# EAGLE design matrix (EAGLE 8.1.0)
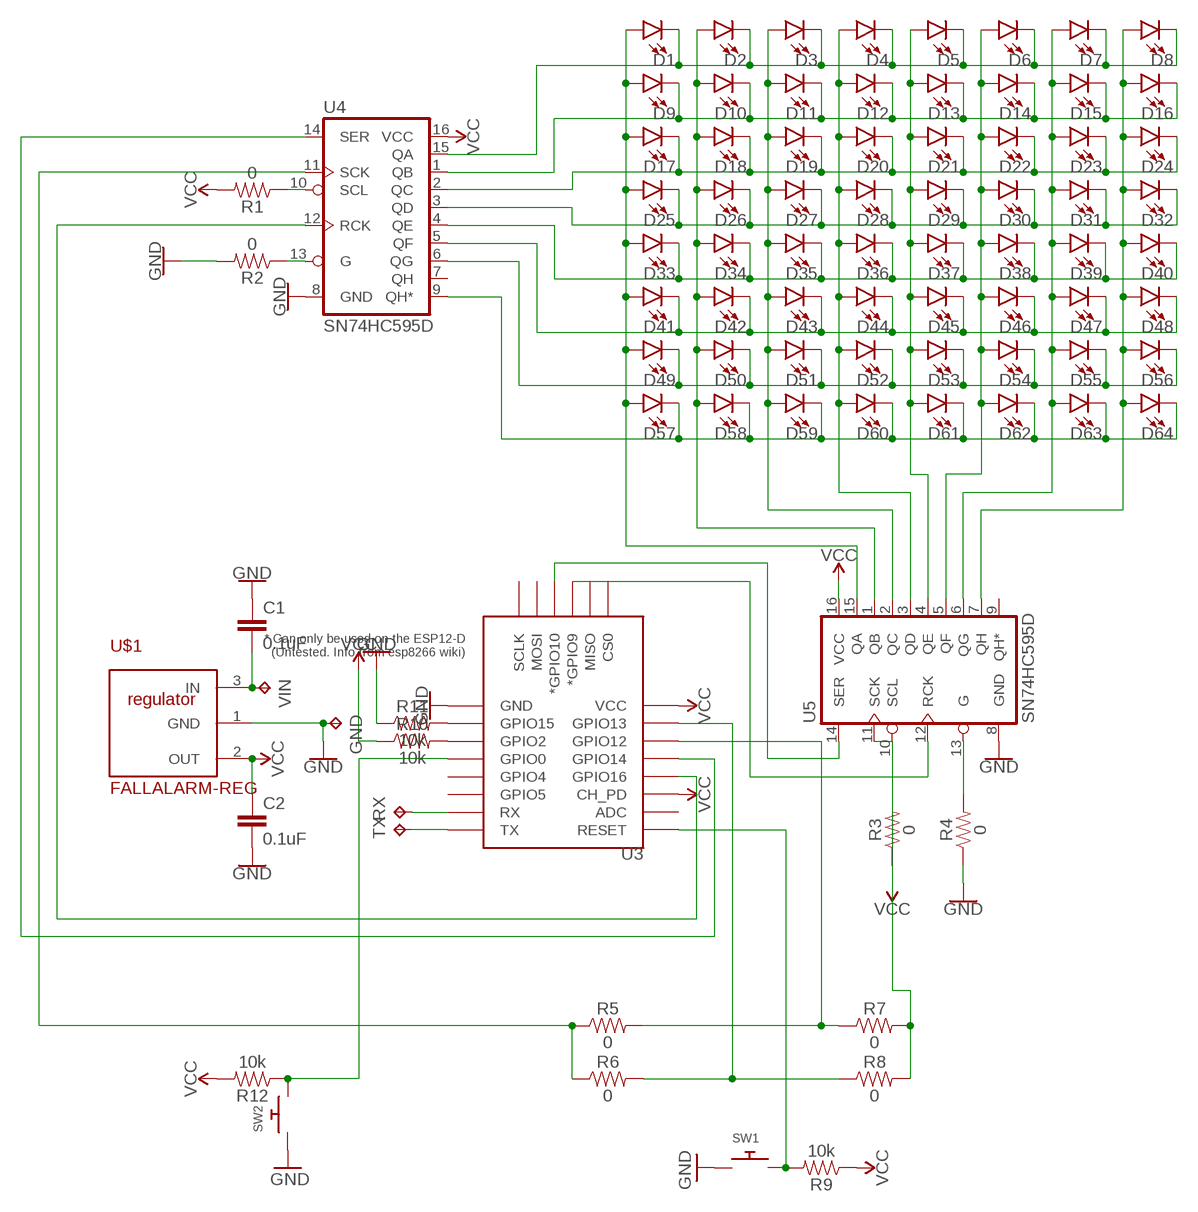
[diagram p0: schematic, sheet 1]

## Parts
C1  0.1uF  0.1UF-0603-25V-(+80/-20%)  [0603]
C2  0.1uF  0.1UF-0603-25V-(+80/-20%)  [0603]
D1  LED0603  [LED-0603]
D2  LED0603  [LED-0603]
D3  LED0603  [LED-0603]
D4  LED0603  [LED-0603]
D5  LED0603  [LED-0603]
D6  LED0603  [LED-0603]
D7  LED0603  [LED-0603]
D8  LED0603  [LED-0603]
D9  LED0603  [LED-0603]
D10  LED0603  [LED-0603]
D11  LED0603  [LED-0603]
D12  LED0603  [LED-0603]
D13  LED0603  [LED-0603]
D14  LED0603  [LED-0603]
D15  LED0603  [LED-0603]
D16  LED0603  [LED-0603]
D17  LED0603  [LED-0603]
D18  LED0603  [LED-0603]
D19  LED0603  [LED-0603]
D20  LED0603  [LED-0603]
D21  LED0603  [LED-0603]
D22  LED0603  [LED-0603]
D23  LED0603  [LED-0603]
D24  LED0603  [LED-0603]
D25  LED0603  [LED-0603]
D26  LED0603  [LED-0603]
D27  LED0603  [LED-0603]
D28  LED0603  [LED-0603]
D29  LED0603  [LED-0603]
D30  LED0603  [LED-0603]
D31  LED0603  [LED-0603]
D32  LED0603  [LED-0603]
D33  LED0603  [LED-0603]
D34  LED0603  [LED-0603]
D35  LED0603  [LED-0603]
D36  LED0603  [LED-0603]
D37  LED0603  [LED-0603]
D38  LED0603  [LED-0603]
D39  LED0603  [LED-0603]
D40  LED0603  [LED-0603]
D41  LED0603  [LED-0603]
D42  LED0603  [LED-0603]
D43  LED0603  [LED-0603]
D44  LED0603  [LED-0603]
D45  LED0603  [LED-0603]
D46  LED0603  [LED-0603]
D47  LED0603  [LED-0603]
D48  LED0603  [LED-0603]
D49  LED0603  [LED-0603]
D50  LED0603  [LED-0603]
D51  LED0603  [LED-0603]
D52  LED0603  [LED-0603]
D53  LED0603  [LED-0603]
D54  LED0603  [LED-0603]
D55  LED0603  [LED-0603]
D56  LED0603  [LED-0603]
D57  LED0603  [LED-0603]
D58  LED0603  [LED-0603]
D59  LED0603  [LED-0603]
D60  LED0603  [LED-0603]
D61  LED0603  [LED-0603]
D62  LED0603  [LED-0603]
D63  LED0603  [LED-0603]
D64  LED0603  [LED-0603]
GND  TPPAD1-17  [P1-17]
R1  0  0OHM-0603-1/10W-5%  [0603]
R2  0  0OHM-0603-1/10W-5%  [0603]
R3  0  0OHM-0603-1/10W-5%  [0603]
R4  0  0OHM-0603-1/10W-5%  [0603]
R5  0  0OHM-0603-1/10W-5%  [0603]
R6  0  0OHM-0603-1/10W-5%  [0603]
R7  0  0OHM-0603-1/10W-5%  [0603]
R8  0  0OHM-0603-1/10W-5%  [0603]
R9  10k  10KOHM-0603-1/10W-1%  [0603]
R10  10k  10KOHM-0603-1/10W-1%  [0603]
R11  10k  10KOHM-0603-1/10W-1%  [0603]
R12  10k  10KOHM-0603-1/10W-1%  [0603]
RX  TPTP20SQ  [TP20SQ]
SW1  SWITCH_PUSHBUTTONEVQ-PE  [TACT_PANA-EVQ]
SW2  SWITCH_PUSHBUTTONEVQ-PE  [TACT_PANA-EVQ]
TX  TPTP20SQ  [TP20SQ]
U3  ESP12ESMD  [ESP12E-SMD]
U4  SN74HC595D  74HC595D  [SO16]
U5  SN74HC595D  74HC595D  [SO16]
U$1  FALLALARM-REG  [SOT23]
VIN  TPPAD1-17  [P1-17]

## Nets
GND: C1.1 C2.2 GND.TP R2.2 R4.1 R11.1 SW1.P$1 SW2.P$1 U3.GND U4.8(GND) U5.8(GND) U$1.1(GND)
N$1: D1.C D2.C D3.C D4.C D5.C D6.C D7.C D8.C U4.15(QA)
N$2: TX.TP U3.TXD0(TX)
N$3: D1.A D9.A D17.A D25.A D33.A D41.A D49.A D57.A U5.15(QA)
N$4: D2.A D10.A D18.A D26.A D34.A D42.A D50.A D58.A U5.1(QB)
N$5: D3.A D11.A D19.A D27.A D35.A D43.A D51.A D59.A U5.2(QC)
N$6: D4.A D12.A D20.A D28.A D36.A D44.A D52.A D60.A U5.3(QD)
N$7: D5.A D13.A D21.A D29.A D37.A D45.A D53.A D61.A U5.4(QE)
N$8: D6.A D14.A D22.A D30.A D38.A D46.A D54.A D62.A U5.5(QF)
N$9: D7.A D15.A D23.A D31.A D39.A D47.A D55.A D63.A U5.6(QG)
N$10: D8.A D16.A D24.A D32.A D40.A D48.A D56.A D64.A U5.7(QH)
N$11: D17.C D18.C D19.C D20.C D21.C D22.C D23.C D24.C U4.2(QC)
N$12: D25.C D26.C D27.C D28.C D29.C D30.C D31.C D32.C U4.3(QD)
N$13: D9.C D10.C D11.C D12.C D13.C D14.C D15.C D16.C U4.1(QB)
N$14: D33.C D34.C D35.C D36.C D37.C D38.C D39.C D40.C U4.4(QE)
N$15: D41.C D42.C D43.C D44.C D45.C D46.C D47.C D48.C U4.5(QF)
N$16: U3.GPIO14 U4.14(SER)
N$17: U3.GPIO10(*GPIO10) U5.14(SER)
N$18: U3.GPIO9(*GPIO9) U5.12(RCK)
N$19: U3.GPIO16 U4.12(RCK)
N$20: R1.1 U4.10(SCL)
N$21: R3.2 U5.10(SCL)
N$22: R2.1 U4.13(G)
N$23: R4.2 U5.13(G)
N$24: R5.1 R6.1 U4.11(SCK)
N$25: D57.C D58.C D59.C D60.C D61.C D62.C D63.C D64.C U4.9(QH*)
N$26: C1.2 U$1.3(IN) VIN.TP
N$27: RX.TP U3.RXD0(RX)
N$28: R5.2 R7.1 U3.GPIO12
N$29: D49.C D50.C D51.C D52.C D53.C D54.C D55.C D56.C U4.6(QG)
N$30: R10.2 U3.GPIO2
N$31: R11.2 U3.GPIO15
N$32: R9.2 SW1.P$2
N$33: R6.2 R8.1 U3.GPIO13
N$34: R7.2 R8.2 U5.11(SCK)
N$35: R12.1 SW2.P$2 U3.GPIO0
VCC: C2.1 R1.2 R3.1 R9.1 R10.1 R12.2 U3.CH_PD U3.VCC U4.16(VCC) U5.16(VCC) U$1.2(OUT)
Unconnected: U3.ADC U3.CS0 U3.GPIO4 U3.GPIO5 U3.MISO U3.MOSI U3.RESET U3.SCLK U4.7(QH) U5.9(QH*)

## Library data of the parts
C1 C2 = SparkFun-Capacitors:0.1UF: 0.1µF ceramic capacitors A capacitor is a passive two-terminal electrical component used to store electrical energy temporarily in an electric field.; PROD_ID: CAP-00810
D1-D64 = SparkFun-LED:LED: LED (Generic) Standard schematic elements and footprints for 5mm, 3mm, 1206, and 0603 sized LEDs. Generic LEDs with no color specified.
GND RX TX VIN = testpad:TP: Test pad
R1-R8 = SparkFun-Resistors:0OHM: 0Ω resistor A resistor is a passive two-terminal electrical component that implements electrical resistance as a circuit element. Resistors act to reduce current flow, and, at the same time, act to lower voltage levels within circuits. - Wikipedia; PROD_ID: RES-08609
R9-R12 = SparkFun-Resistors:10KOHM: 10kΩ resistor A resistor is a passive two-terminal electrical component that implements electrical resistance as a circuit element. Resistors act to reduce current flow, and, at the same time, act to lower voltage levels within circuits. - Wikipedia; PROD_ID: RES-00824
SW1 SW2 = adafruit:SWITCH_PUSHBUTTON: Buttons SOFTTOUCHSMD_SJ - Soft touch temporary push button (Super Junk Akihabara) Compatible with SKPMANE010 [Mouser: 688-SKPMAN] C&K_KSS = Digikey: KSS221GLFS
U3 = esp8266modules:ESP12E: ESP12E Module
U4 U5 = SparkFun-IC-Logic:74*595: 8-Bit Shift Register (Serial to Parallel) Datasheet <http://cdn.sparkfun.com/datasheets/BreakoutBoards/MM74HC595.pdf> SparkFun Products SparkFun Shift Register Breakout - 74HC595 <https://www.sparkfun.com/products/10680> (BOB-10680); PROD_ID: IC-07875
U$1 = v-reg:FALLALARM-REG

## Board
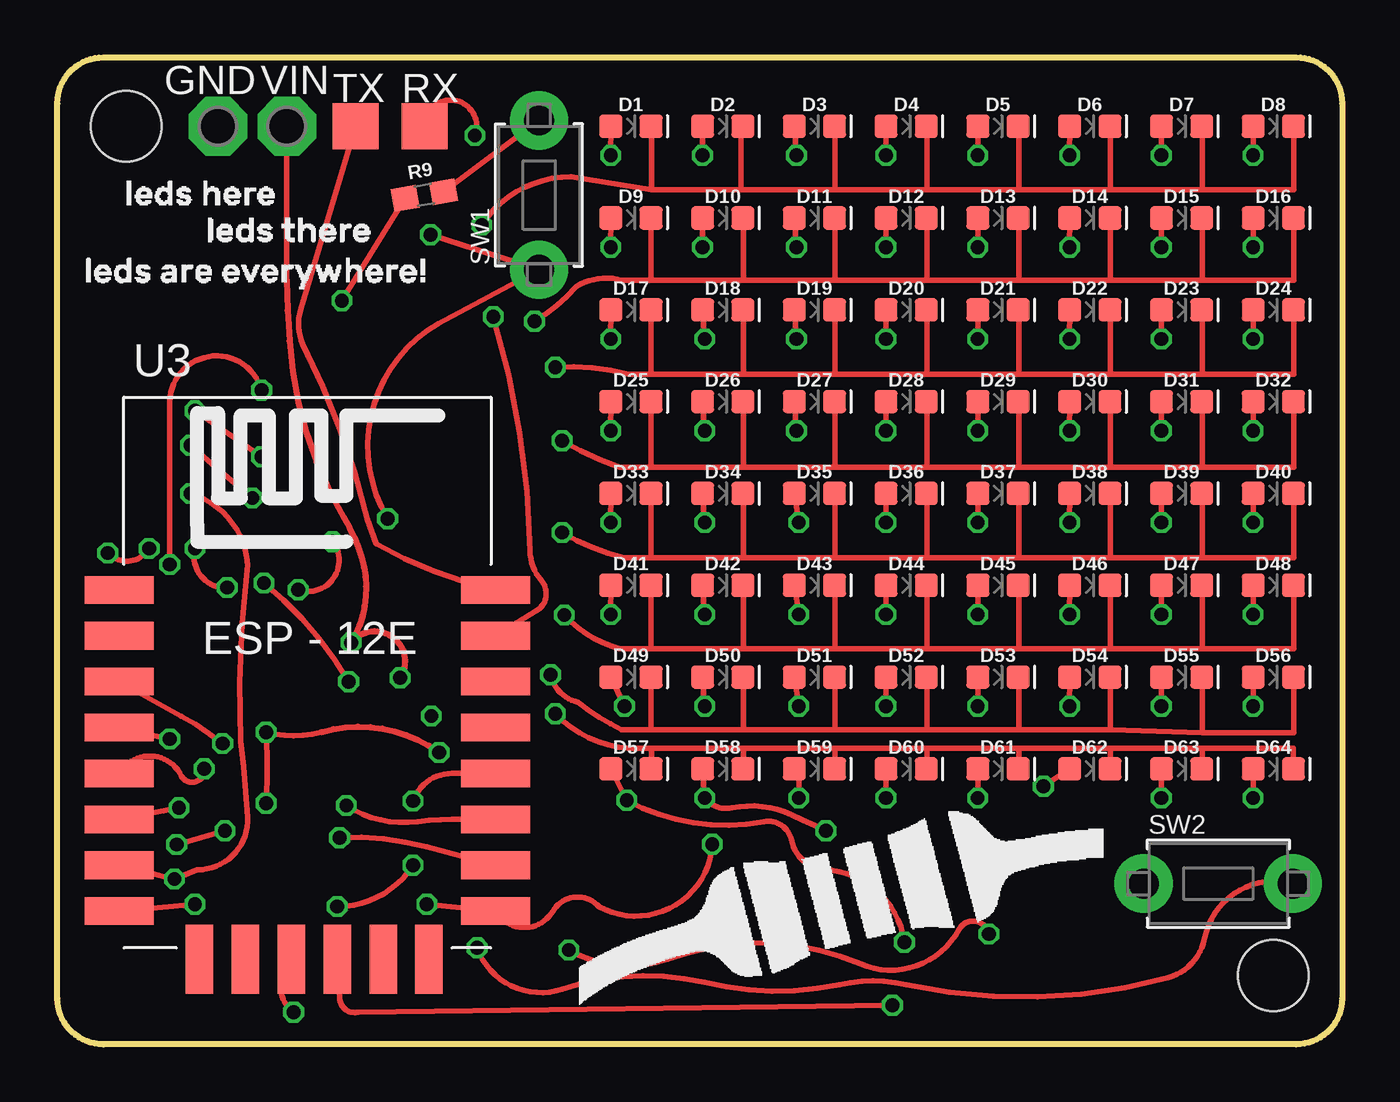
[diagram p1: board, top side]
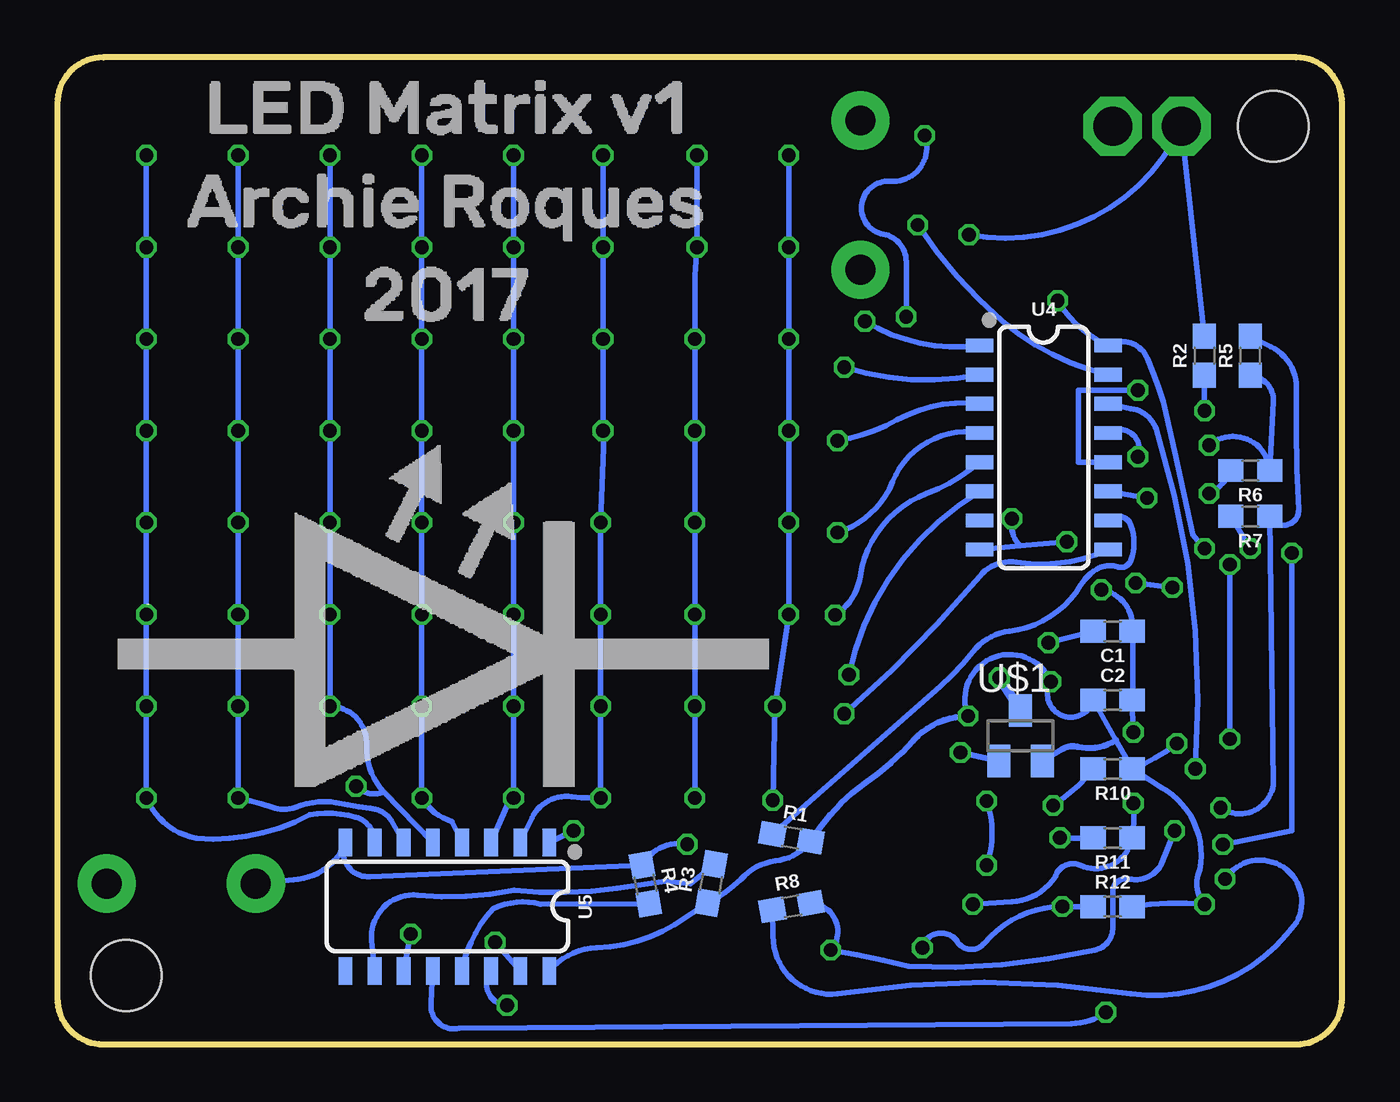
[diagram p2: board, bottom side, seen from below]

Size 56 x 43 mm. Coordinates in mm from the lower left corner, seen from the top.
Outline: 0,41 arc-90 2,43 54,43 arc-90 56,41 56,2 arc-90 54,0 2,0 arc-90 0,2 0,41
Copper layers (1*16): Top 0.035mm / dielectric 1.5mm / Bottom 0.035mm
Design rules "SeeedStudio_2layer_DRU_no_angle_20140221": minimum track width 6mil, minimum drill 12mil, track to track 6mil, track to pad 6mil, pad to pad 6mil, via to via 6mil, smd to smd 0mil, copper to edge 10mil, drill to drill 10mil, minimum pad ring 10mil, minimum via ring 6mil, stop-mask expansion 2mil, vias tented up to drill 100mil, thermal gap 10mil
Holes 3.1 mm at 3,40 53,3

### Footprints (pad centres in the part's own frame; a part is rotated, then mirrored left to right if it is on the bottom)
0603 = smd 1.1 x 1: 1 -0.85,0; 2 0.85,0
LED-0603 = smd 1 x 1: A -0.877,0; C 0.877,0
P1-17 = drill 1.702 pad 2.54 octagon: TP 0,0
TP20SQ = smd 2 x 2: TP 0,0
TACT_PANA-EVQ = drill 1.3 pad 2.54: P$1 -3.25,0; P$2 3.25,0
ESP12E-SMD = smd 3 x 1.2: ADC -8.3,3.8; CH_PD -8.3,1.8; GND 8.1,-8.2; GPIO0 8.1,-2.2; GPIO2 8.1,-4.2; GPIO4 8.1,-0.2; GPIO5 8.1,1.8; GPIO12 -8.3,-4.2; GPIO13 -8.3,-6.2; GPIO14 -8.3,-2.2; GPIO15 8.1,-6.2; GPIO16 -8.3,-0.2; RESET -8.3,5.8; RXD0 8.1,3.8; TXD0 8.1,5.8; VCC -8.3,-8.2 | smd 1.2 x 3: CS0 -4.8,-10.3; GPIO9 -0.8,-10.3; GPIO10 1.2,-10.3; MISO -2.8,-10.3; MOSI 3.2,-10.3; SCLK 5.2,-10.3
SO16 = smd 0.6 x 1.2: 1 -4.445,-2.8; 2 -3.175,-2.8; 3 -1.905,-2.8; 4 -0.635,-2.8; 5 0.635,-2.8; 6 1.905,-2.8; 7 3.175,-2.8; 8 4.445,-2.8; 9 4.445,2.8; 10 3.175,2.8; 11 1.905,2.8; 12 0.635,2.8; 13 -0.635,2.8; 14 -1.905,2.8; 15 -3.175,2.8; 16 -4.445,2.8
SOT23 = smd 1 x 1.4: 1 -0.95,-1.1; 2 0.95,-1.1; 3 0,1.1

### Placement (x,y rotation side)
C1  10,18 180 bottom
C2  10,15 0 bottom
D1  25,40 0 top
D2  29,40 0 top
D3  33,40 0 top
D4  37,40 0 top
D5  41,40 0 top
D6  45,40 0 top
D7  49,40 0 top
D8  53,40 0 top
D9  25,36 0 top
D10  29,36 0 top
D11  33,36 0 top
D12  37,36 0 top
D13  41,36 0 top
D14  45,36 0 top
D15  49,36 0 top
D16  53,36 0 top
D17  25,32 0 top
D18  29,32 0 top
D19  33,32 0 top
D20  37,32 0 top
D21  41,32 0 top
D22  45,32 0 top
D23  49,32 0 top
D24  53,32 0 top
D25  25,28 0 top
D26  29,28 0 top
D27  33,28 0 top
D28  37,28 0 top
D29  41,28 0 top
D30  45,28 0 top
D31  49,28 0 top
D32  53,28 0 top
D33  25,24 0 top
D34  29,24 0 top
D35  33,24 0 top
D36  37,24 0 top
D37  41,24 0 top
D38  45,24 0 top
D39  49,24 0 top
D40  53,24 0 top
D41  25,20 0 top
D42  29,20 0 top
D43  33,20 0 top
D44  37,20 0 top
D45  41,20 0 top
D46  45,20 0 top
D47  49,20 0 top
D48  53,20 0 top
D49  25,16 0 top
D50  29,16 0 top
D51  33,16 0 top
D52  37,16 0 top
D53  41,16 0 top
D54  45,16 0 top
D55  49,16 0 top
D56  53,16 0 top
D57  25,12 0 top
D58  29,12 0 top
D59  33,12 0 top
D60  37,12 0 top
D61  41,12 0 top
D62  45,12 0 top
D63  49,12 0 top
D64  53,12 0 top
GND  7,40 0 top
R1  24,9 350 bottom
R2  6,30 90 bottom
R3  27.5,7 80 bottom
R4  30.37,6.97 280 bottom
R5  4,30 90 bottom
R6  4,25 180 bottom
R7  4,23 180 bottom
R8  24,6 10 bottom
R9  16,37 10 top
R10  10,12 180 bottom
R11  10,9 180 bottom
R12  10,6 0 bottom
RX  16,40 0 top
SW1  21,37 90 top
SW2  50.6,7 0 top
TX  13,40 0 top
U3  11,14 0 top
U4  13,26 270 bottom
U5  39,6 180 bottom
U$1  14.02,13.44 0 bottom
VIN  10,40 0 top

### Tracks (layer width: path | path; a pad name or v marks a point on that pad's centre or on a via)
GND  (via drill 0.6)
  Top 0.25: v28.54,8.71 arc-115 23.6,6 arc108 21.6,5.8 arc-119 U3.GND v16.1,6.1 | v9.1,10.5 arc7 v9.1,13.6 arc28 11.5,13.6 | v10.5,19.8 arc146 v12,21.9 | v14.4,22.9 arc-91 16.6,31.4 SW1.P$1 v16.27,35.28
  Top 0.254: 11.5,13.6 arc-52 v16.64,12.71
  Bottom 0.25: v28.54,8.71 arc-70 R4.1 42.4,7.3 arc116 U5.8 arc63 45.5,7.2 SW2.P$1 | v9.1,10.5 arc14 R11.1 arc106 11.4,7.8 arc-98 12.5,7.3 arc53 14.4,6.2 v16.1,6.1 | v9.1,13.6 arc1 C2.2 arc-5 C1.1 arc-89 v10.5,19.8 | 14.06,21.71 U4.8 | 14.06,21.71 v12,21.9 | v14.4,22.9 arc-51 14.06,21.71 | R2.2 GND.TP arc75 v16.27,35.28
  Bottom 0.254: v16.64,12.71 U$1.1
N$1  (via drill 0.6)
  Top 0.25: D8.C 53.9,40 53.9,37.24 49.9,37.24 | 29.8,37.24 25.9,37.24 | 33.9,37.24 29.8,37.24 | 37.9,37.24 33.9,37.24 | 41.9,37.24 37.9,37.24 | 45.9,37.24 41.9,37.24 | 49.9,37.24 45.9,37.24 | 25.9,37.24 22.4,37.8 arc57 v18.5,35.7 | D1.C 25.9,40 25.9,37.24 | D2.C 29.8,40 29.8,37.24 | D3.C 33.9,40 33.9,37.24 | D4.C 37.9,40 37.9,37.24 | D5.C 41.9,40 41.9,37.24 | D6.C 45.9,40 45.9,37.24 | D7.C 49.9,40 49.9,37.24
  Bottom 0.25: v18.5,35.7 arc-16 14.8,31.5 arc-28 U4.15
N$2
  Top 0.25: TX.TP 10.6,32 arc41 10.7,30.5 arc-14 13.5,22.9 13.9,21.8 arc16 U3.TXD0
N$3  (via drill 0.6)
  Top 0.25: v36.92,4.44 arc82 33.4,7.6 arc-71 32,8.9 arc89 30.8,9.7 arc-39 v24.82,10.63 D57.A | D1.A v24.12,38.73 | v24.12,34.73 D9.A | v24.12,30.73 D17.A | v24.12,26.73 D25.A | v24.12,22.73 D33.A | v24.12,18.73 D41.A | v24.72,14.73 D49.A
  Bottom 0.25: U5.15 v36.92,4.44 | v24.12,38.73 v24.12,34.73 v24.12,30.73 v24.12,26.73 v24.12,22.73 v24.12,18.73 v24.72,14.73 v24.82,10.63
N$4  (via drill 0.6)
  Top 0.25: v33.5,9.3 arc1 32,10 arc36 29.4,10.3 arc-63 v28.22,10.73 D58.A | D2.A v28.12,38.73 | v28.12,34.73 D10.A | v28.22,30.73 D18.A | v28.22,26.73 D26.A | v28.22,22.73 D34.A | v28.22,18.73 D42.A | v28.22,14.73 D50.A
  Bottom 0.25: U5.1 v33.5,9.3 | v28.12,38.73 v28.12,34.73 28.2,33.5 v28.22,30.73 v28.22,26.73 v28.22,22.73 v28.22,18.73 v28.22,14.73 v28.22,10.73
N$5  (via drill 0.6)
  Top 0.25: D3.A v32.22,38.73 | v32.22,34.73 D11.A | v32.22,30.73 D19.A | v32.22,26.73 D27.A | v32.32,22.73 D35.A | v32.32,18.73 D43.A | v32.32,14.73 D51.A | D59.A 32.32,12 v32.32,10.73
  Bottom 0.25: v32.22,38.73 v32.22,34.73 v32.22,30.73 v32.22,26.73 32.2,26 v32.32,22.73 v32.32,18.73 v32.32,14.73 v32.32,10.73 arc6 33.58,10.78 arc-73 35.31,9.87 U5.2
N$6  (via drill 0.6)
  Top 0.25: D4.A v36.12,38.73 | v36.12,34.73 D12.A | v36.12,30.73 D20.A | v36.12,26.73 D28.A | v36.12,22.73 D36.A | v36.12,18.73 D44.A | v36.12,14.73 D52.A | v36.12,10.73 D60.A
  Bottom 0.25: U5.3 36.4,10.4 arc35 v36.12,10.73 v36.12,14.73 v36.12,18.73 v36.12,22.73 v36.12,26.73 v36.12,30.73 v36.12,34.73 v36.12,38.73
N$7  (via drill 0.6)
  Top 0.25: D5.A v40.12,38.73 | v40.12,34.73 D13.A | v40.12,30.73 D21.A | v40.12,26.73 D29.A | v40.12,22.73 D37.A | v40.12,18.73 D45.A | v40.12,14.73 D53.A | v40.12,10.73 D61.A
  Bottom 0.25: v40.12,38.73 v40.12,34.73 v40.12,30.73 v40.12,26.73 v40.12,22.73 v40.12,18.73 v40.12,14.73 v40.12,10.73 arc-42 38.8,9.7 U5.4
N$8  (via drill 0.6)
  Top 0.25: D6.A v44.12,38.73 | v44.12,34.73 D14.A | v44.12,30.73 D22.A | v44.12,26.73 D30.A | v44.12,22.73 D38.A | v44.12,18.73 D46.A | v44.12,14.73 D54.A | D62.A v42.98,11.24
  Bottom 0.25: v44.12,38.73 v44.12,34.73 v44.12,30.73 v44.12,26.73 v44.12,22.73 v44.12,18.73 v44.12,14.73 arc92 42.52,13.02 arc-47 41.76,10.99 | 41.76,10.99 U5.5 | v42.98,11.24 arc-66 41.76,10.99
N$9  (via drill 0.6)
  Top 0.25: D7.A v48.12,38.73 | v48.12,34.73 D15.A | v48.12,30.73 D23.A | v48.12,26.73 D31.A | v48.12,22.73 D39.A | v48.12,18.73 D47.A | v48.12,14.73 D55.A | v48.12,10.73 D63.A
  Bottom 0.25: v48.12,38.73 v48.12,34.73 v48.12,30.73 v48.12,26.73 v48.12,22.73 v48.12,18.73 v48.12,14.73 v48.12,10.73 arc6 46.64,10.33 arc-36 45.62,10.33 arc31 43.84,10.53 arc-5 42.37,10.27 arc53 41.46,9.77 U5.6
N$10  (via drill 0.6)
  Top 0.25: D8.A v52.12,38.73 | v52.12,34.73 D16.A | v52.12,30.73 D24.A | v52.12,26.73 D32.A | v52.12,22.73 D40.A | v52.12,18.73 D48.A | v52.12,14.73 D56.A | v52.12,10.73 D64.A
  Bottom 0.25: U5.7 arc-76 43,9.9 arc-25 45,10 arc33 49.95,8.97 arc56 v52.12,10.73 v52.12,14.73 v52.12,18.73 v52.12,22.73 v52.12,26.73 v52.12,30.73 v52.12,34.73 v52.12,38.73
N$11  (via drill 0.6)
  Top 0.25: D24.C 53.9,32 53.9,29.19 49.9,29.19 | 33.9,29.19 29.9,29.19 | 37.9,29.19 33.9,29.19 | 41.9,29.19 37.9,29.19 | 45.9,29.19 41.9,29.19 | 49.9,29.19 45.9,29.19 | 29.9,29.19 25.88,29.19 | 25.88,29.19 D17.C | D18.C 29.9,32 29.9,29.19 | D19.C 33.9,32 33.9,29.19 | D20.C 37.9,32 37.9,29.19 | D21.C 41.9,32 41.9,29.19 | D22.C 45.9,32 45.9,29.19 | D23.C 49.9,32 49.9,29.19 | 25.88,29.19 24.9,29.19 arc18 v21.7,29.5
  Bottom 0.25: v21.7,29.5 arc-29 U4.2
N$12  (via drill 0.6)
  Top 0.25: D32.C 53.9,28 53.9,25.14 49.9,25.14 | 33.9,25.14 29.9,25.14 | 37.9,25.14 33.9,25.14 | 41.9,25.14 37.9,25.14 | 45.9,25.14 41.9,25.14 | 49.9,25.14 45.9,25.14 | 29.9,25.14 26,25.14 25.88,25.14 | 25.88,25.14 D25.C | D26.C 29.9,28 29.9,25.14 | D27.C 33.9,28 33.9,25.14 | D28.C 37.9,28 37.9,25.14 | D29.C 41.9,28 41.9,25.14 | D30.C 45.9,28 45.9,25.14 | D31.C 49.9,28 49.9,25.14 | 25.88,25.14 24.5,25.14 arc-9 v22,26.3
  Bottom 0.25: v22,26.3 arc-20 19.4,27.2 arc36 U4.3
N$13  (via drill 0.6)
  Top 0.25: D16.C 53.9,36 53.9,33.29 49.9,33.29 | 33.9,33.29 29.9,33.29 | 37.9,33.29 33.9,33.29 | 41.9,33.29 37.9,33.29 | 45.9,33.29 41.9,33.29 | 49.9,33.29 45.9,33.29 | 29.9,33.29 25.88,33.29 | 25.88,33.29 D9.C | D10.C 29.9,36 29.9,33.29 | D11.C 33.9,36 33.9,33.29 | D12.C 37.9,36 37.9,33.29 | D13.C 41.9,36 41.9,33.29 | D14.C 45.9,36 45.9,33.29 | D15.C 49.9,36 49.9,33.29 | 25.88,33.29 24.6,33.29 arc48 22.6,33 arc-17 v20.8,31.5
  Bottom 0.25: v20.8,31.5 arc-38 U4.1
N$14  (via drill 0.6)
  Top 0.25: D40.C 53.9,24 53.9,21.19 49.9,21.19 | 33.9,21.19 29.9,21.19 | 37.9,21.19 33.9,21.19 | 41.9,21.19 37.9,21.19 | 45.9,21.19 41.9,21.19 | 49.9,21.19 45.9,21.19 | 29.9,21.19 25.88,21.19 | 25.88,21.19 D33.C | D34.C 29.9,24 29.9,21.19 | D35.C 33.9,24 33.9,21.19 | D36.C 37.9,24 37.9,21.19 | D37.C 41.9,24 41.9,21.19 | D38.C 45.9,24 45.9,21.19 | D39.C 49.9,24 49.9,21.19 | 25.88,21.19 24.7,21.19 arc-17 v22,22.3
  Bottom 0.25: v22,22.3 arc-51 19.6,24.5 arc78 U4.4
N$15  (via drill 0.6)
  Top 0.25: D48.C 53.9,20 53.9,17.24 49.9,17.24 | 33.9,17.24 29.9,17.24 | 37.9,17.24 33.9,17.24 | 41.9,17.24 37.9,17.24 | 45.9,17.24 41.9,17.24 | 49.9,17.24 45.9,17.24 | 29.9,17.24 25.88,17.24 | 25.88,17.24 D41.C | D42.C 29.9,20 29.9,17.24 | D43.C 33.9,20 33.9,17.24 | D44.C 37.9,20 37.9,17.24 | D45.C 41.9,20 41.9,17.24 | D46.C 45.9,20 45.9,17.24 | D47.C 49.9,20 49.9,17.24 | 25.88,17.24 24.5,17.24 arc-33 v22.1,18.7
  Bottom 0.25: v22.1,18.7 arc-49 21,20.4 arc61 18.1,24 arc-20 U4.5
N$16  (via drill 0.6)
  Top 0.25: v6.4,12 arc-159 5.4,11.7 arc124 U3.GPIO14
  Bottom 0.25: U4.14 9.2,27.7 arc61 8.1,26.8 arc22 v6.4,12
N$17  (via drill 0.6)
  Top 0.25: U3.GPIO10 12.3,2 arc100 13.1,1.4 v36.4,1.7
  Bottom 0.25: v36.4,1.7 arc125 U5.14
N$18  (via drill 0.6)
  Top 0.25: v10.3,1.4 arc-101 U3.GPIO9
  Bottom 0.25: U5.12 39.7,1.8 arc-112 38.5,0.7 11.8,0.9 arc-37 v10.3,1.4
N$19  (via drill 0.6)
  Top 0.25: U3.GPIO16 v4.9,13.3 | v4.9,20.9 4.9,28 arc-163 v8.9,28.5
  Bottom 0.25: v4.9,13.3 v4.9,20.9 | v8.9,28.5 11.5,28.5 11.5,25.36 U4.12
N$20
  Bottom 0.25: R1.1 17.5,15.6 arc-10 16.1,17.1 arc45 14.5,18 arc-52 11.4,20 arc28 10.7,20.7 arc49 9.8,20.8 arc-90 9.2,21.1 arc-37 9.2,22.6 arc-118 U4.10
N$21
  Bottom 0.25: U5.10 42.3,4.5 arc101 40.3,6.5 arc-16 36.1,6.7 arc-14 31.6,6.8 29.5,7.1 28.4,7 R3.2
N$22  (via drill 0.6)
  Top 0.25: v6,27.6 v8.9,25.6
  Bottom 0.25: R2.1 v6,27.6 | v8.9,25.6 arc-146 U4.13
N$23
  Bottom 0.25: R4.2 34.95,6.1 arc-42 37,5.91 arc-33 U5.13
N$24  (via drill 0.6)
  Top 0.25: v8.5,23.8 v5.8,26.1
  Bottom 0.25: R5.1 arc88 3,28 R6.1 arc-126 v5.8,26.1 | U4.11 v8.5,23.8
N$25  (via drill 0.6)
  Top 0.25: D57.C 25.9,12 25.9,12.89 | 29.9,12.89 25.9,12.89 | 33.9,12.89 29.9,12.89 | 37.9,12.89 33.9,12.89 | 41.9,12.89 37.9,12.89 | 45.9,12.89 41.9,12.89 | 49.9,12.89 45.9,12.89 | 49.9,12.89 53.88,12.89 D64.C | D58.C 29.9,12 29.9,12.89 | D59.C 33.9,12 33.9,12.89 | D60.C 37.9,12 37.9,12.89 | D61.C 41.9,12 41.9,12.89 | D62.C 45.9,12 45.9,12.89 | D63.C 49.9,12 49.9,12.89 | 25.9,12.89 24.9,12.89 arc-41 v21.7,14.4
  Bottom 0.25: v21.7,14.4 arc-9 15.8,20.4 arc59 14.2,21 arc-33 U4.9
N$26  (via drill 0.6)
  Top 0.25: VIN.TP 10,33.3
  Top 0.254: v14.94,15.97 arc174 v12.8,17.5 arc48 13.26,21.2 arc14 12.5,22.92 arc-23 10.27,29.33 arc-8 10,33.3
  Bottom 0.25: v12.8,17.5 C1.2
  Bottom 0.406: U$1.3 v14.94,15.97
N$27  (via drill 0.6)
  Top 0.25: U3.RXD0 20.9,18.9 arc100 21.1,20.2 arc-40 20.6,21.5 arc16 v19,31.7 | v18.2,39.6 arc201 RX.TP
  Bottom 0.25: v19,31.7 19,34.1 arc-80 20,35.3 arc174 19.7,37.6 arc-115 v18.2,39.6
N$28  (via drill 0.6)
  Top 0.25: v5.3,10.3 U3.GPIO12
  Bottom 0.25: R5.2 3.1,30.4 arc64 2,28.6 arc-3 1.9,23.3 arc158 R7.1 3,11.3 arc115 v5.3,10.3
N$29  (via drill 0.6)
  Top 0.25: D56.C 53.9,16 53.9,13.58 49.9,13.58 | 45.9,13.7 49.9,13.58 | 41.9,13.7 45.9,13.7 | 37.9,13.7 41.9,13.7 | 33.9,13.7 37.9,13.7 | 29.9,13.7 33.9,13.7 | 29.9,13.7 25.88,13.7 | 25.88,13.7 D49.C | D55.C 49.9,16 49.9,13.58 | D54.C 45.9,16 45.9,13.7 | D53.C 41.9,16 41.9,13.7 | D52.C 37.9,16 37.9,13.7 | D51.C 33.9,16 33.9,13.7 | D50.C 29.9,16 29.9,13.7 | 25.88,13.7 24.6,13.7 arc-12 22.7,14.9 arc-66 v21.5,16.1
  Bottom 0.25: v21.5,16.1 arc47 U4.6
N$30  (via drill 0.6)
  Top 0.25: U3.GPIO2 17.2,9.8 arc8 15.7,9.7 arc-41 v12.6,10.4
  Bottom 0.25: v12.6,10.4 arc-19 R10.2
N$31  (via drill 0.6)
  Top 0.25: U3.GPIO15 16.1,8.6 arc18 v12.3,9
  Bottom 0.25: v12.3,9 arc-6 R11.2
N$32
  Top 0.25: SW1.P$2 R9.2
N$33  (via drill 0.6)
  Top 0.25: U3.GPIO13 v5.1,7.2 6.1,7.6 arc93 8.3,9.9 arc2 8,13.2 arc-10 8.3,20.9 arc69 v5.8,24
  Bottom 0.25: R8.1 24.8,4.7 arc-97 22,2.2 arc18 9.2,2.2 arc-62 2,5.3 arc-176 v5.1,7.2 | v5.8,24 arc-40 R6.2
N$34  (via drill 0.6)
  Top 0.25: v40.6,4.8 arc141 39.3,5 arc-85 35,3.5 arc44 26.6,3.7 arc-48 v22.29,4.1 | v4,21.6 arc-105 v2.2,21.4 | v5.2,8.7 v7.3,9.3
  Bottom 0.25: U5.11 v40.6,4.8 | R8.2 arc129 v22.29,4.1 arc5 18.9,3.4 arc-16 10.8,4.1 arc-86 10,5.2 10,6.7 arc95 9.3,7.2 arc-70 7.9,7.8 v7.3,9.3 | R7.2 v4,21.6 | v2.2,21.4 2.2,9.3 v5.2,8.7
N$35  (via drill 0.6)
  Top 0.25: v15.5,7.8 arc-57 v12.2,6 | U3.GPIO0 17.2,11.8 arc70 v15.5,10.6 | v18.3,4.2 arc89 22,2.4 arc-31 28.2,2.7 arc26 34.1,2.6 arc-26 37,2.6 arc28 48.4,2.9 arc64 50,4.6 arc-93 SW2.P$2
  Bottom 0.25: R12.1 v12.2,6 arc-50 15.6,4.4 arc110 16.8,4.5 arc-130 v18.3,4.2 | v15.5,10.6 arc39 v15.5,7.8
VCC  (via drill 0.6)
  Top 0.25: U3.VCC v6,6.1 | R9.1 v12.4,32.4 | v9,20.1 arc-20 v12.7,15.8 | U3.CH_PD 5.4,14.3 arc-9 v7.2,13.1 | v7.4,19.9 arc-108 v6,21.6
  Bottom 0.25: U5.16 arc48 32.5,4.2 arc-29 29.1,5.2 R3.1 arc-16 26.2,7.2 arc38 24.7,8 arc-48 R1.2 | R12.2 arc14 v6,6.1 arc67 6.2,7.6 arc-72 7.9,11.2 R10.1 | v12.4,32.4 arc-35 U4.16 arc98 8.5,29.9 arc6 7.8,28 7.3,25.8 6.5,22.2 v6,21.6 | v16.3,14.3 arc179 v12.7,15.8 arc-196 C2.1 9.86,13.25 R10.1 | v7.2,13.1 arc18 R10.1 | v9,20.1 v7.4,19.9
  Bottom 0.254: U$1.2 12.2,12.87 arc44 11.53,12.97 arc-46 9.86,13.25 | R1.2 arc23 20.78,11.39 arc-15 18.7,13.22 arc49 v16.3,14.3